# Altium schematic sheet LoRa.SchDoc
size A; SheetNumber: 4; SheetTotal: 4
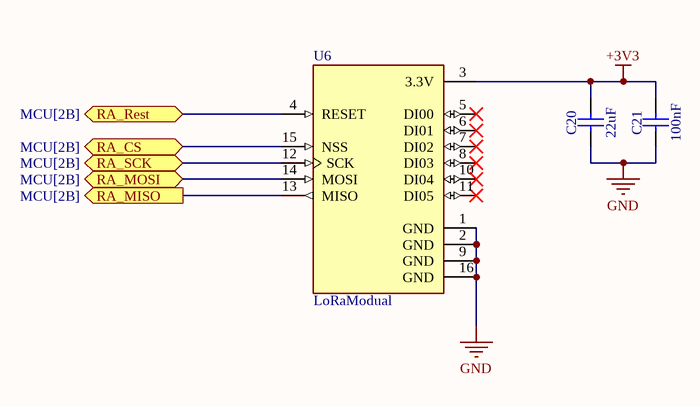
[diagram p0: LoRa.SchDoc]

## Parts
C20  22uF  [CAPC1608X90N]
C21  100nF  [CAPC1608X90N]
U6  LoRaModual  [IC.RA-02]

## Ports
RA_CS (bidir, see MCU[2B]), RA_MISO (out, see MCU[2B]), RA_MOSI (bidir, see MCU[2B]), RA_Rest (bidir, see MCU[2B]), RA_SCK (bidir, see MCU[2B])

## Nets
+3V3: C20.2 C21.2 U6.3(3.3V)
GND: C20.1 C21.1 U6.1(GND) U6.2(GND) U6.9(GND) U6.16(GND)
RA_CS: U6.15(NSS) ; port RA_CS
RA_MISO: U6.13(MISO) ; port RA_MISO
RA_MOSI: U6.14(MOSI) ; port RA_MOSI
RA_Rest: U6.4(RESET) ; port RA_Rest
RA_SCK: U6.12(SCK) ; port RA_SCK

Not connected (* = marked no-connect by the designer): U6 5(DI00)* 6(DI01)* 7(DI02)* 8(DI03)* 10(DI04)* 11(DI05)*

## Library data of the parts
C20 = CC0603_22UF_6.3V_20%_X5R: Non-polarised capacitor; Part Description: SMD Multilayer Chip Ceramic Capacitor; Manufacturer: GENERIC; Manufacturer1 Part Number: C1608X5R0J226M080; Voltage: 6.3V; TC: X5R; Tolerance: ±20%; Part Number: CC0603_22UF_6.3V_20%_X5R; Component Kind: Standard; Component Type: Standard; Pin Count: 2; Value: 22uF; Status: None; Manufacturer Part Number: CC0603_22UF_6.3V_20%_X5R; Case: 0603; Mounted: Yes; Socket: No; SMD: Yes; Sense: No; Manufacturer1 Example: TDK; Manufacturer1 ComponentHeight: 0.9mm; HelpURL: \\cern.ch\dfs\Applications\Altium\Datasheets\CC0603_X5R_TDK_C.pdf; Author: CERN DEM JLC; CreateDate: 12/16/2013; LatestRevisionDate: 12/3/2020
C21 = CC0603_100NF_100V_10%_X7R: Non-polarised capacitor; Part Description: SMD Multilayer Chip Ceramic Capacitor; Manufacturer: GENERIC; Manufacturer1 Part Number: GRM188R72A104KA35D; Voltage: 100V; TC: X7R; Tolerance: ±10%; Part Number: CC0603_100NF_100V_10%_X7R; Component Kind: Standard; Component Type: Standard; Pin Count: 2; Value: 100nF; Status: None; Manufacturer Part Number: CC0603_100NF_100V_10%_X7R; Case: 0603; Mounted: Yes; Socket: No; SMD: Yes; Sense: No; Manufacturer1 Example: MURATA; Manufacturer1 ComponentHeight: 0.9mm; HelpURL: \\cern.ch\dfs\Applications\Altium\Datasheets\CC0603_MURATA_GRM188R72A104KA35D.pdf; Author: CERN DEM JLC; CreateDate: 12/11/2013; LatestRevisionDate: 12/11/2013
U6 = IC.RA-02: General ISM < 1GHz LoRaâ„¢ Transceiver Module 410MHz ~ 525MHz Antenna Not Included, I-PEX Surface Mount; MF: Ai-Thinker; MP: RA-02; SnapEDA_Link: https://www.snapeda.com/parts/RA-02/AI-Thinker/view-part/?ref=snap; Package: None; Value: *; Check_prices: https://www.snapeda.com/parts/RA-02/AI-Thinker/view-part/?ref=eda